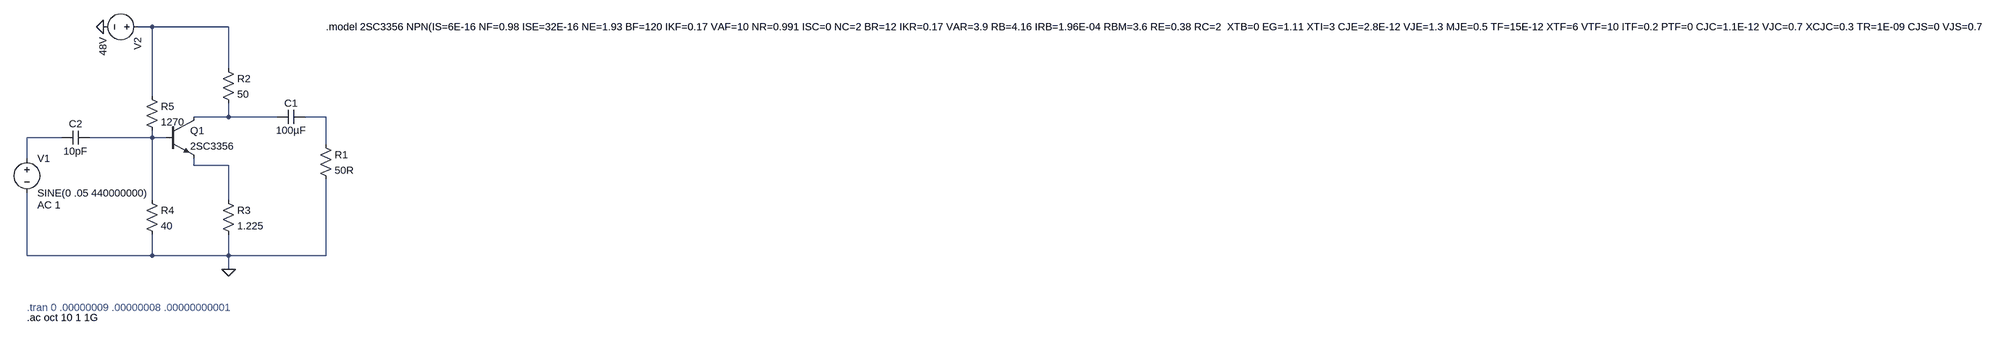
[diagram p0: schematic RF front end amplifier.asc]
RF front end amplifier.asc, the LTspice schematic file:
Version 4.1
SHEET 1 5668 680
WIRE 400 -224 368 -224
WIRE 576 -224 400 -224
WIRE 576 -128 576 -224
WIRE 400 -64 400 -224
WIRE 576 -16 576 -48
WIRE 576 -16 496 -16
WIRE 688 -16 576 -16
WIRE 800 -16 752 -16
WIRE 192 32 112 32
WIRE 400 32 400 16
WIRE 400 32 256 32
WIRE 432 32 400 32
WIRE 800 48 800 -16
WIRE 112 80 112 32
WIRE 496 96 496 80
WIRE 576 96 496 96
WIRE 400 176 400 32
WIRE 576 176 576 96
WIRE 112 304 112 160
WIRE 400 304 400 256
WIRE 400 304 112 304
WIRE 576 304 576 256
WIRE 576 304 400 304
WIRE 800 304 800 128
WIRE 800 304 576 304
WIRE 576 336 576 304
FLAG 576 336 0
FLAG 288 -224 0
SYMBOL voltage 112 64 R0
WINDOW 123 24 124 Left 2
WINDOW 39 0 0 Left 0
SYMATTR InstName V1
SYMATTR Value SINE(0 .05 440000000)
SYMATTR Value2 AC 1
SYMBOL res 784 32 R0
SYMATTR InstName R1
SYMATTR Value 50R
SYMBOL npn 432 -16 R0
SYMATTR InstName Q1
SYMATTR Value 2SC3356
SYMBOL res 560 -144 R0
SYMATTR InstName R2
SYMATTR Value 50
SYMBOL res 560 160 R0
SYMATTR InstName R3
SYMATTR Value 1.225
SYMBOL res 384 160 R0
SYMATTR InstName R4
SYMATTR Value 40
SYMBOL res 384 -80 R0
SYMATTR InstName R5
SYMATTR Value 1270
SYMBOL voltage 384 -224 R90
WINDOW 123 0 0 Left 0
WINDOW 39 0 0 Left 0
SYMATTR InstName V2
SYMATTR Value 48V
SYMBOL cap 752 -32 R90
WINDOW 0 0 32 VBottom 2
WINDOW 3 32 32 VTop 2
SYMATTR InstName C1
SYMATTR Value 100µF
SYMBOL cap 256 16 R90
WINDOW 0 0 32 VBottom 2
WINDOW 3 32 32 VTop 2
SYMATTR InstName C2
SYMATTR Value 10pF
TEXT 112 424 Left 2 ;.tran 0 .00000009 .00000008 .00000000001
TEXT 112 448 Left 2 !.ac oct 10 1 1G
TEXT 800 -224 Left 2 !.model 2SC3356 NPN(IS=6E-16 NF=0.98 ISE=32E-16 NE=1.93 BF=120 IKF=0.17 VAF=10 NR=0.991 ISC=0 NC=2 BR=12 IKR=0.17 VAR=3.9 RB=4.16 IRB=1.96E-04 RBM=3.6 RE=0.38 RC=2  XTB=0 EG=1.11 XTI=3 CJE=2.8E-12 VJE=1.3 MJE=0.5 TF=15E-12 XTF=6 VTF=10 ITF=0.2 PTF=0 CJC=1.1E-12 VJC=0.7 XCJC=0.3 TR=1E-09 CJS=0 VJS=0.75 MJS=0 FC=0.5 Vceo=12 Icrating=100m mfg=cel)

The netlist it stands for:
* RF front end amplifier.asc
V1 N004 0 SINE(0 .05 440000000) AC 1
R1 N003 0 50R
Q1 N002 N005 N006 0 2SC3356
R2 N001 N002 50
R3 N006 0 1.225
R4 N005 0 40
R5 N001 N005 1270
V2 N001 0 48V
C1 N003 N002 100µF
C2 N005 N004 10pF
.model NPN NPN
.model PNP PNP
.lib standard.bjt
* .tran 0 .00000009 .00000008 .00000000001
.ac oct 10 1 1G
.model 2SC3356 NPN(IS=6E-16 NF=0.98 ISE=32E-16 NE=1.93 BF=120 IKF=0.17 VAF=10 NR=0.991 ISC=0 NC=2 BR=12 IKR=0.17 VAR=3.9 RB=4.16 IRB=1.96E-04 RBM=3.6 RE=0.38 RC=2  XTB=0 EG=1.11 XTI=3 CJE=2.8E-12 VJE=1.3 MJE=0.5 TF=15E-12 XTF=6 VTF=10 ITF=0.2 PTF=0 CJC=1.1E-12 VJC=0.7 XCJC=0.3 TR=1E-09 CJS=0 VJS=0.75 MJS=0 FC=0.5 Vceo=12 Icrating=100m mfg=cel)
.backanno
.end